# Altium project 超级电容组_高能高泄_330.PrjPcb
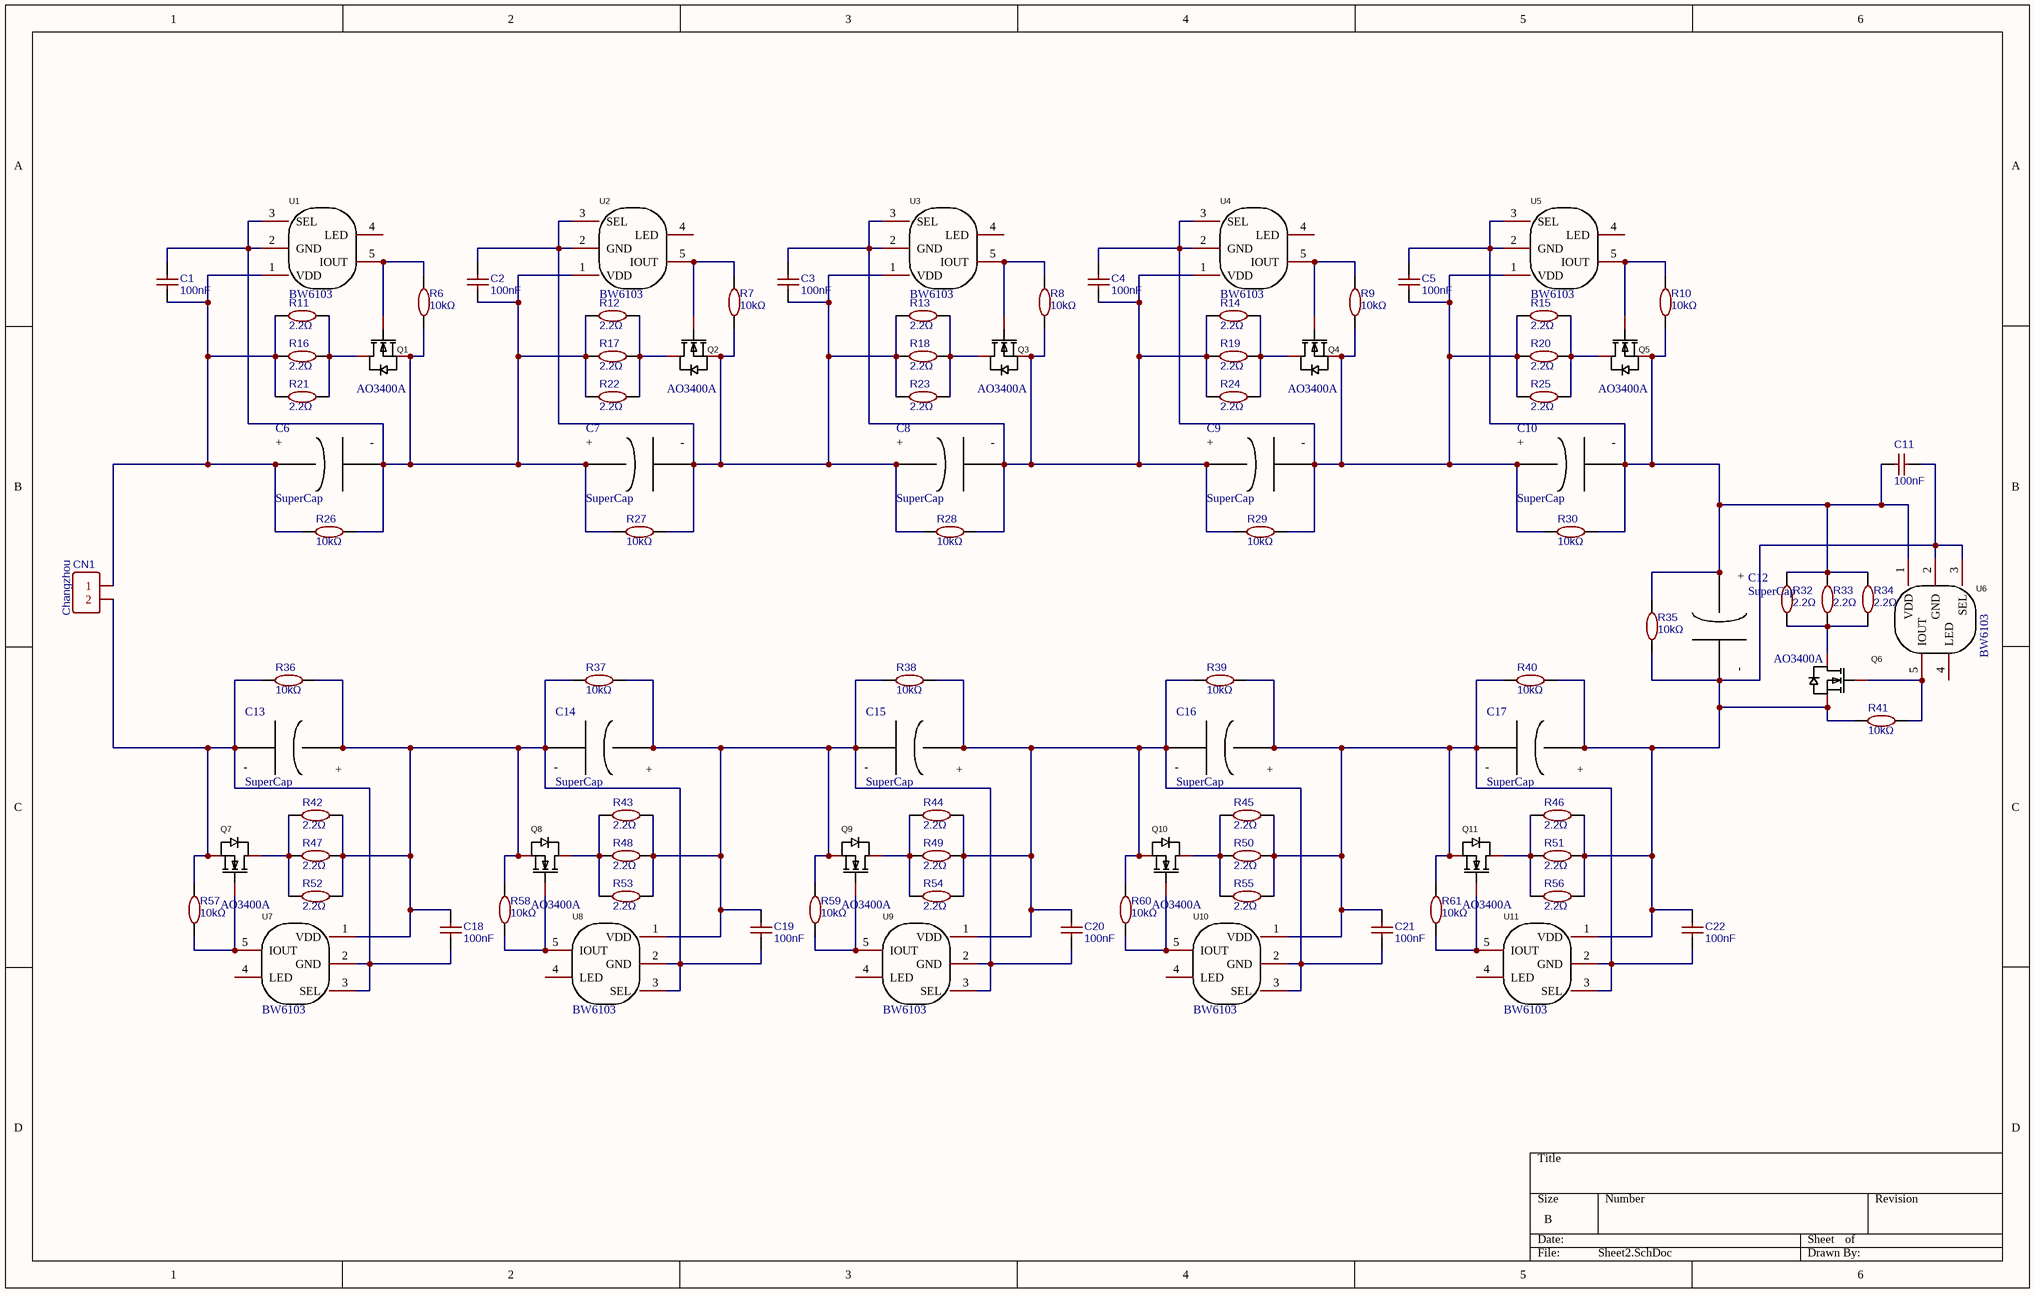
[diagram p0: Sheet2.SchDoc]
1 sheet, 100 parts. Net scope: global (net labels, ports and power ports of the same name join across sheets).
Board file: PCB2.PcbDoc

## Sheet Sheet2.SchDoc
size B; SheetNumber: 1; SheetTotal: 1

### Parts
C1  100nF  [C-RAD-0603]
C2  100nF  [C-RAD-0603]
C3  100nF  [C-RAD-0603]
C4  100nF  [C-RAD-0603]
C5  100nF  [C-RAD-0603]
C6  SuperCap  [C_supercap1]
C7  SuperCap  [C_supercap1]
C8  SuperCap  [C_supercap1]
C9  SuperCap  [C_supercap1]
C10  SuperCap  [C_supercap1]
C11  100nF  [C-RAD-0603]
C12  SuperCap  [C_supercap1]
C13  SuperCap  [C_supercap1]
C14  SuperCap  [C_supercap1]
C15  SuperCap  [C_supercap1]
C16  SuperCap  [C_supercap1]
C17  SuperCap  [C_supercap1]
C18  100nF  [C-RAD-0603]
C19  100nF  [C-RAD-0603]
C20  100nF  [C-RAD-0603]
C21  100nF  [C-RAD-0603]
C22  100nF  [C-RAD-0603]
CN1  Changzhou  [CONN-TH_XT30UPB-F]
Q1  AO3400A  [SOT-23]
Q2  AO3400A  [SOT-23]
Q3  AO3400A  [SOT-23]
Q4  AO3400A  [SOT-23]
Q5  AO3400A  [SOT-23]
Q6  AO3400A  [SOT-23]
Q7  AO3400A  [SOT-23]
Q8  AO3400A  [SOT-23]
Q9  AO3400A  [SOT-23]
Q10  AO3400A  [SOT-23]
Q11  AO3400A  [SOT-23]
R6  10kΩ  [0603-1]
R7  10kΩ  [0603-1]
R8  10kΩ  [0603-1]
R9  10kΩ  [0603-1]
R10  10kΩ  [0603-1]
R11  2.2Ω  [2512]
R12  2.2Ω  [2512]
R13  2.2Ω  [2512]
R14  2.2Ω  [2512]
R15  2.2Ω  [2512]
R16  2.2Ω  [2512]
R17  2.2Ω  [2512]
R18  2.2Ω  [2512]
R19  2.2Ω  [2512]
R20  2.2Ω  [2512]
R21  2.2Ω  [2512]
R22  2.2Ω  [2512]
R23  2.2Ω  [2512]
R24  2.2Ω  [2512]
R25  2.2Ω  [2512]
R26  10kΩ  [0603-1]
R27  10kΩ  [0603-1]
R28  10kΩ  [0603-1]
R29  10kΩ  [0603-1]
R30  10kΩ  [0603-1]
R32  2.2Ω  [2512]
R33  2.2Ω  [2512]
R34  2.2Ω  [2512]
R35  10kΩ  [0603-1]
R36  10kΩ  [0603-1]
R37  10kΩ  [0603-1]
R38  10kΩ  [0603-1]
R39  10kΩ  [0603-1]
R40  10kΩ  [0603-1]
R41  10kΩ  [0603-1]
R42  2.2Ω  [2512]
R43  2.2Ω  [2512]
R44  2.2Ω  [2512]
R45  2.2Ω  [2512]
R46  2.2Ω  [2512]
R47  2.2Ω  [2512]
R48  2.2Ω  [2512]
R49  2.2Ω  [2512]
R50  2.2Ω  [2512]
R51  2.2Ω  [2512]
R52  2.2Ω  [2512]
R53  2.2Ω  [2512]
R54  2.2Ω  [2512]
R55  2.2Ω  [2512]
R56  2.2Ω  [2512]
R57  10kΩ  [0603-1]
R58  10kΩ  [0603-1]
R59  10kΩ  [0603-1]
R60  10kΩ  [0603-1]
R61  10kΩ  [0603-1]
U1  BW6103  [SOT-23-5_L3.0-W1.7-P0.95-LS2.8-BL]
U2  BW6103  [SOT-23-5_L3.0-W1.7-P0.95-LS2.8-BL]
U3  BW6103  [SOT-23-5_L3.0-W1.7-P0.95-LS2.8-BL]
U4  BW6103  [SOT-23-5_L3.0-W1.7-P0.95-LS2.8-BL]
U5  BW6103  [SOT-23-5_L3.0-W1.7-P0.95-LS2.8-BL]
U6  BW6103  [SOT-23-5_L3.0-W1.7-P0.95-LS2.8-BL]
U7  BW6103  [SOT-23-5_L3.0-W1.7-P0.95-LS2.8-BL]
U8  BW6103  [SOT-23-5_L3.0-W1.7-P0.95-LS2.8-BL]
U9  BW6103  [SOT-23-5_L3.0-W1.7-P0.95-LS2.8-BL]
U10  BW6103  [SOT-23-5_L3.0-W1.7-P0.95-LS2.8-BL]
U11  BW6103  [SOT-23-5_L3.0-W1.7-P0.95-LS2.8-BL]

### Nets
NetC1_1: C1.1 C6.1 CN1.1 R11.2 R16.2 R21.2 R26.1 U1.1(VDD)
NetC1_2: C1.2 C2.1 C6.2 C7.1 Q1.2(S) R6.1 R12.2 R17.2 R22.2 R26.2 R27.1 U1.2(GND) U1.3(SEL) U2.1(VDD)
NetC2_2: C2.2 C3.1 C7.2 C8.1 Q2.2(S) R7.1 R13.2 R18.2 R23.2 R27.2 R28.1 U2.2(GND) U2.3(SEL) U3.1(VDD)
NetC3_2: C3.2 C4.1 C8.2 C9.1 Q3.2(S) R8.1 R14.2 R19.2 R24.2 R28.2 R29.1 U3.2(GND) U3.3(SEL) U4.1(VDD)
NetC4_2: C4.2 C5.1 C9.2 C10.1 Q4.2(S) R9.1 R15.2 R20.2 R25.2 R29.2 R30.1 U4.2(GND) U4.3(SEL) U5.1(VDD)
NetC5_2: C5.2 C10.2 C11.1 C12.1 Q5.2(S) R10.1 R30.2 R32.2 R33.2 R34.2 R35.1 U5.2(GND) U5.3(SEL) U6.1(VDD)
NetC11_2: C11.2 C12.2 C17.1 C22.1 Q6.2(S) R35.2 R40.1 R41.1 R46.2 R51.2 R56.2 U6.2(GND) U6.3(SEL) U11.1(VDD)
NetC13_1: C13.1 C14.2 C18.1 C19.2 Q8.2(S) R36.1 R37.2 R42.2 R47.2 R52.2 R58.1 U7.1(VDD) U8.2(GND) U8.3(SEL)
NetC13_2: C13.2 C18.2 CN1.2 Q7.2(S) R36.2 R57.1 U7.2(GND) U7.3(SEL)
NetC14_1: C14.1 C15.2 C19.1 C20.2 Q9.2(S) R37.1 R38.2 R43.2 R48.2 R53.2 R59.1 U8.1(VDD) U9.2(GND) U9.3(SEL)
NetC15_1: C15.1 C16.2 C20.1 C21.2 Q10.2(S) R38.1 R39.2 R44.2 R49.2 R54.2 R60.1 U9.1(VDD) U10.2(GND) U10.3(SEL)
NetC16_1: C16.1 C17.2 C21.1 C22.2 Q11.2(S) R39.1 R40.2 R45.2 R50.2 R55.2 R61.1 U10.1(VDD) U11.2(GND) U11.3(SEL)
NetQ1_1: Q1.1(G) R6.2 U1.5(IOUT)
NetQ1_3: Q1.3(D) R11.1 R16.1 R21.1
NetQ2_1: Q2.1(G) R7.2 U2.5(IOUT)
NetQ2_3: Q2.3(D) R12.1 R17.1 R22.1
NetQ3_1: Q3.1(G) R8.2 U3.5(IOUT)
NetQ3_3: Q3.3(D) R13.1 R18.1 R23.1
NetQ4_1: Q4.1(G) R9.2 U4.5(IOUT)
NetQ4_3: Q4.3(D) R14.1 R19.1 R24.1
NetQ5_1: Q5.1(G) R10.2 U5.5(IOUT)
NetQ5_3: Q5.3(D) R15.1 R20.1 R25.1
NetQ6_1: Q6.1(G) R41.2 U6.5(IOUT)
NetQ6_3: Q6.3(D) R32.1 R33.1 R34.1
NetQ7_1: Q7.1(G) R57.2 U7.5(IOUT)
NetQ7_3: Q7.3(D) R42.1 R47.1 R52.1
NetQ8_1: Q8.1(G) R58.2 U8.5(IOUT)
NetQ8_3: Q8.3(D) R43.1 R48.1 R53.1
NetQ9_1: Q9.1(G) R59.2 U9.5(IOUT)
NetQ9_3: Q9.3(D) R44.1 R49.1 R54.1
NetQ10_1: Q10.1(G) R60.2 U10.5(IOUT)
NetQ10_3: Q10.3(D) R45.1 R50.1 R55.1
NetQ11_1: Q11.1(G) R61.2 U11.5(IOUT)
NetQ11_3: Q11.3(D) R46.1 R51.1 R56.1

Not connected (* = marked no-connect by the designer): U1 4(LED); U2 4(LED); U3 4(LED); U4 4(LED); U5 4(LED); U6 4(LED); U7 4(LED); U8 4(LED); U9 4(LED); U10 4(LED); U11 4(LED)

### Notes on the sheet
- (in symbol 50F 2.7v) +; -

### Library data of the parts
C1-C5 C11 C18-C22 = 100nF: BOM_Manufacturer: Guangdong Fenghua Advanced Tech; BOM_Manufacturer Part: 0805CG330J500NT; nameAlias: Capacitance; Contributor: LCSC; BOM_Supplier: LCSC; BOM_Supplier Part: C157687; BOM_JLCPCB Part Class: Extended Part; spicePre: C; spiceSymbolName: 0805CG330J500NT
C6-C10 C12-C17 = 50F 2.7v
CN1 = Changzhou: BOM_Manufacturer: Changzhou Amass Elec; BOM_Manufacturer Part: XT30UPB-F; nameAlias: Value; Contributor: LCSC; BOM_Supplier: LCSC; BOM_Supplier Part: C108769; BOM_JLCPCB Part Class: Extended Part; spicePre: C; spiceSymbolName: XT30UPB-F
Q1-Q11 = AO3400A_C20917: Manufacturer: AOS; Add into BOM: yes; Type: N沟道; Drain Source Voltage (Vdss): 30V; Continuous Drain Current (Id): 5.7A; Power Dissipation (Pd): 1.4W; Drain Source On Resistance (RDS(on)@Vgs,Id): 26.5mΩ@10V,5.7A; Gate Threshold Voltage (Vgs(th)@Id): 1.5V@250μA; Name: AO3400A; Symbol: AO3400A; Device: AO3400A_C20917; LCSC Part Name: N沟道 30V 5.7A; Supplier Part: C20917; Manufacturer Part: AO3400A; Supplier Footprint: SOT-23-3L; JLCPCB Part Class: Basic Part; Datasheet: https://atta.szlcsc.com/upload/public/pdf/source/20140107/1457706668533.pdf; Supplier: LCSC; Convert to PCB: yes
R6-R10 R26-R30 R35-R41 R57-R61 = 10kΩ: BOM_Manufacturer: UniOhm; BOM_Manufacturer Part: 0603WAF1002T5E; nameAlias: Resistance; Resistance (Ohms): 10K; BOM_Supplier: LCSC; BOM_Supplier Part: C25804; BOM_JLCPCB Part Class: Basic Part; spicePre: R; spiceSymbolName: 0603WAF1002T5E
R11-R25 R32-R34 R42-R56 = 2.2Ω_2512: BOM_Manufacturer: UniOhm; BOM_Manufacturer Part: 0603WAF1002T5E; nameAlias: Resistance; Resistance (Ohms): 10K; BOM_Supplier: LCSC; BOM_Supplier Part: C25804; BOM_JLCPCB Part Class: Basic Part; spicePre: R; spiceSymbolName: 0603WAF1002T5E
U1-U11 = BW6103: Manufacturer: RICHTEK(台湾立锜); Name: RT9013-33GB; Symbol: BW6101; Add into BOM: yes; Output Type: 固定; Output Polarity: 正; Number of Outputs: 1; Maximum Input Voltage: 5.5V; Output Voltage: 3.3V; Dropout Voltage: 400mV@(500mA); Output Current: 500mA; Power Supply Rejection Ratio (PRSS): 50dB@(10kHz); Device: BW6101; Supplier Part: C47773; Manufacturer Part: RT9013-33GB; Supplier Footprint: SOT-23-5; JLCPCB Part Class: Extended Part; Datasheet: https://atta.szlcsc.com/upload/public/pdf/source/20150504/1457707282459.pdf; Supplier: LCSC; Convert to PCB: yes; Quiescent Current (Ground Current): -; Noise: -; Feature: -